# EAGLE schematic StepperDriver (EAGLE 7.2.0)
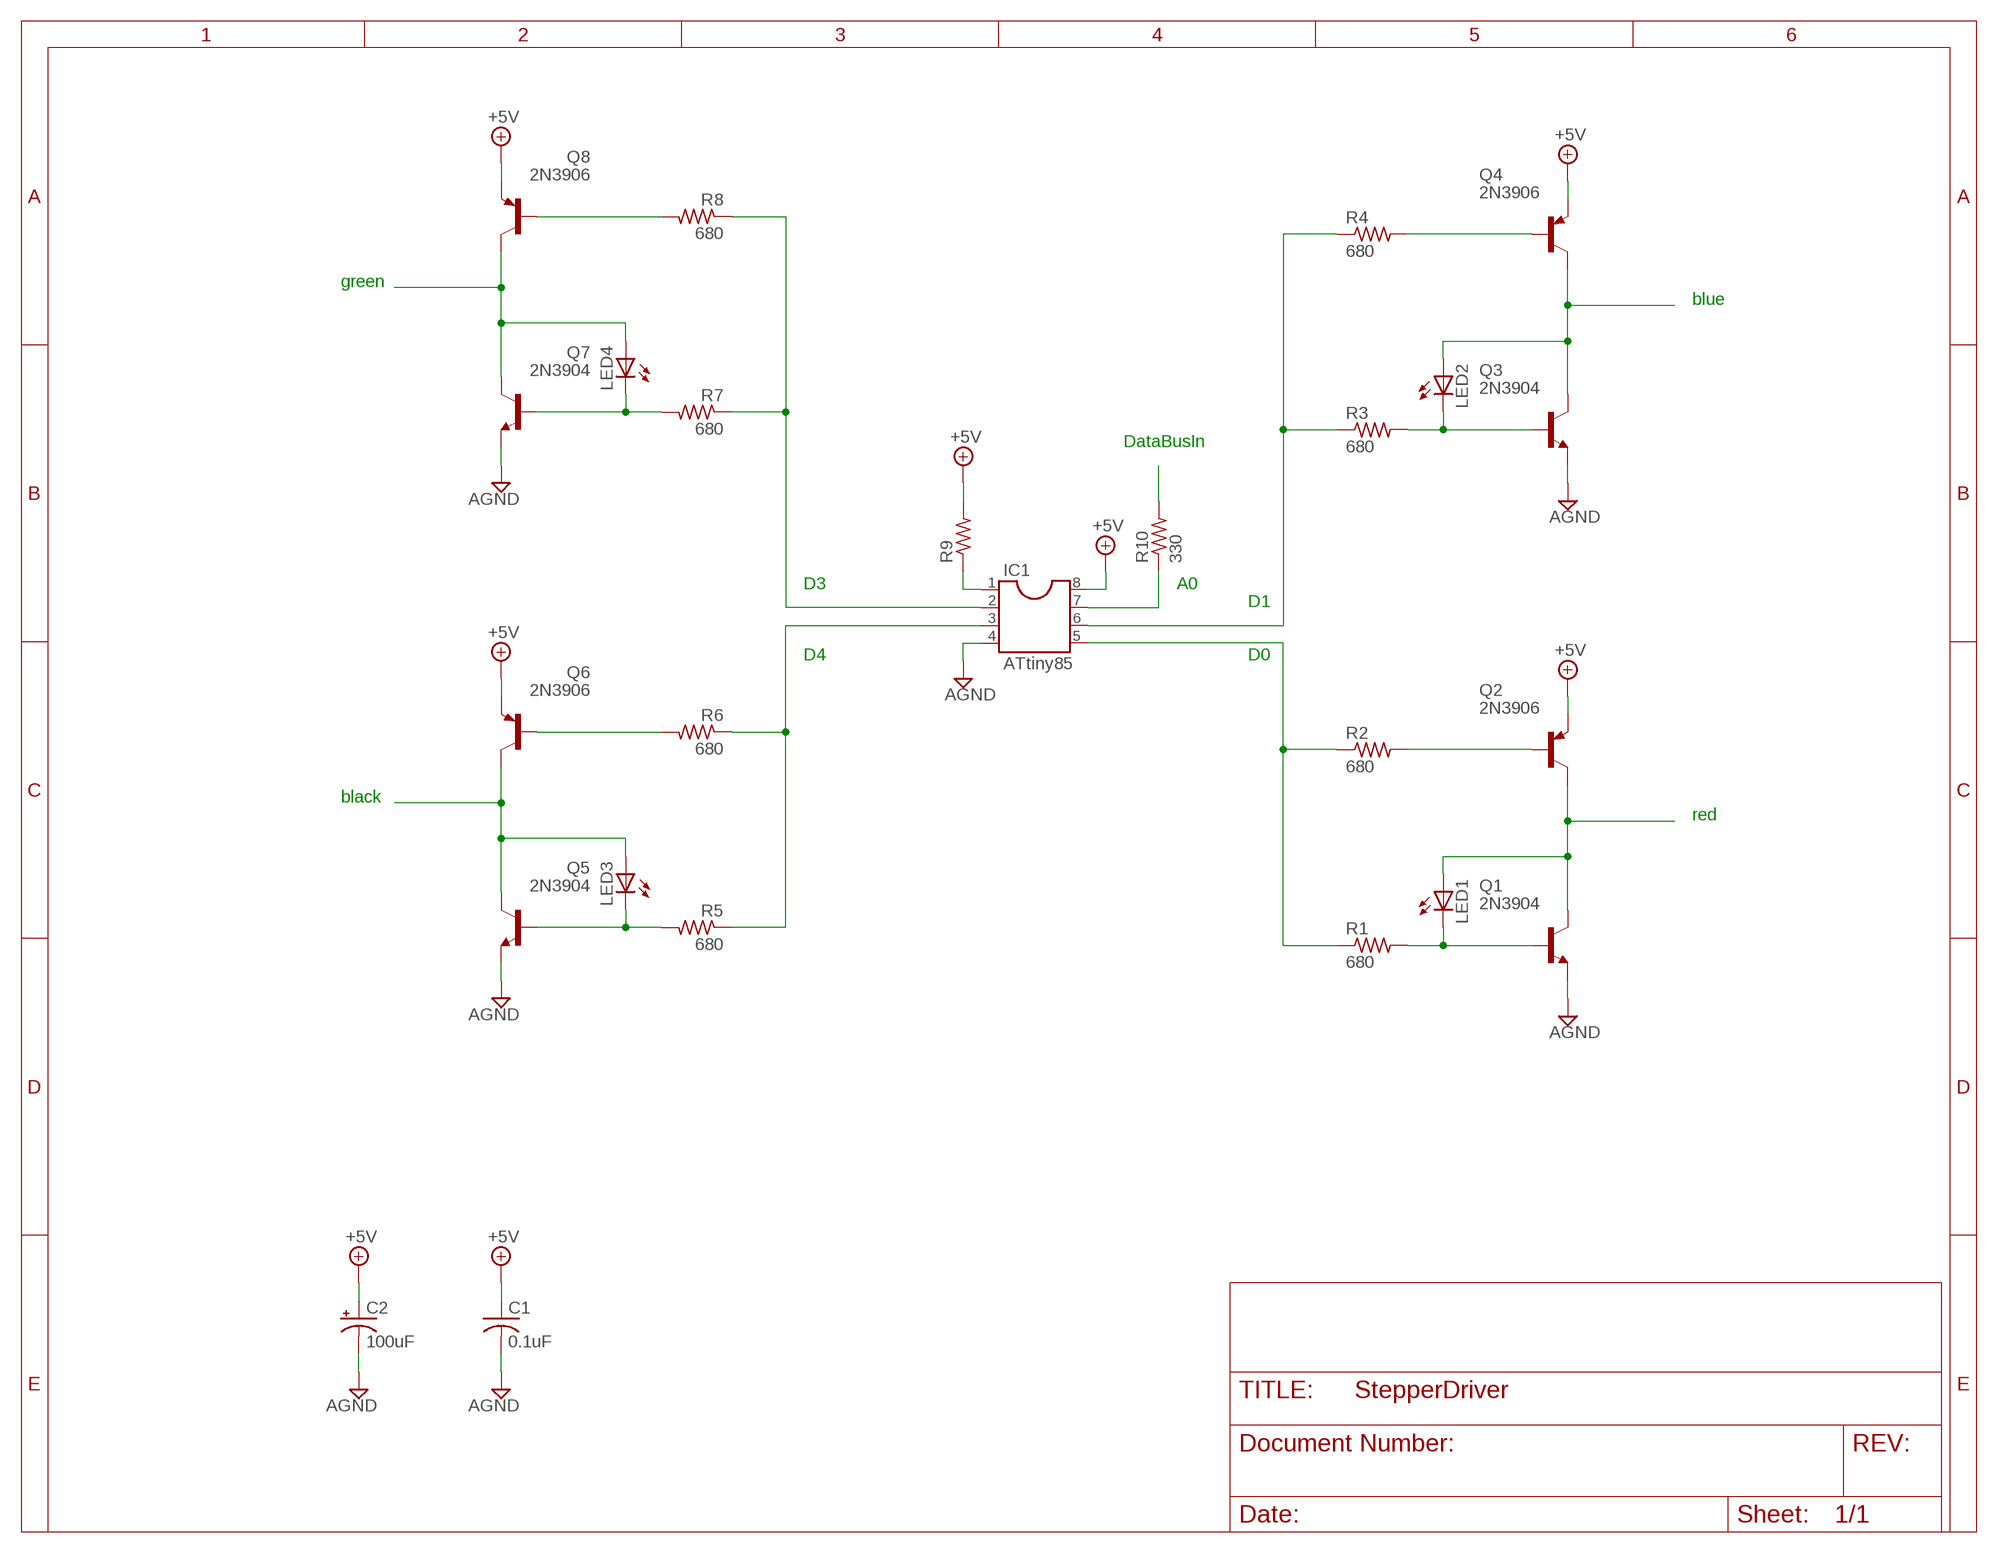
[diagram p0: schematic, sheet 1]

## Parts
C1  0.1uF  C-US025-050X050  [C025-050X050]
C2  100uF  CPOL-USE2,5-6E  [E2,5-6E]
IC1  ATtiny85  DIL8  [DIL08]
LED1  LED5MM  [LED5MM]
LED2  LED5MM  [LED5MM]
LED3  LED5MM  [LED5MM]
LED4  LED5MM  [LED5MM]
Q1  2N3904  [TO92]
Q2  2N3906  [TO92]
Q3  2N3904  [TO92]
Q4  2N3906  [TO92]
Q5  2N3904  [TO92]
Q6  2N3906  [TO92]
Q7  2N3904  [TO92]
Q8  2N3906  [TO92]
R1  680  R-US_VMTA55  [VMTA55]
R2  680  R-US_VMTA55  [VMTA55]
R3  680  R-US_VMTA55  [VMTA55]
R4  680  R-US_VMTA55  [VMTA55]
R5  680  R-US_VMTA55  [VMTA55]
R6  680  R-US_VMTA55  [VMTA55]
R7  680  R-US_VMTA55  [VMTA55]
R8  680  R-US_VMTA55  [VMTA55]
R9  R-US_VMTA55  [VMTA55]
R10  330  R-US_VMTA55  [VMTA55]

## Nets
+5V: C1.1 C2.+ IC1.8 Q2.3(E) Q4.3(E) Q6.3(E) Q8.3(E) R9.2
A0: IC1.7 R10.1
AGND: C1.2 C2.- IC1.4 Q1.3(E) Q3.3(E) Q5.3(E) Q7.3(E)
D0: IC1.5 R1.1 R2.1
D1: IC1.6 R3.1 R4.1
D3: IC1.2 R7.1 R8.1
D4: IC1.3 R5.1 R6.1
N$1: LED2.K(C) Q3.2(B) R3.2
N$2: LED2.A Q3.1(C) Q4.1(C)
N$3: IC1.1 R9.1
N$4: Q4.2(B) R4.2
N$5: LED1.K(C) Q1.2(B) R1.2
N$6: LED1.A Q1.1(C) Q2.1(C)
N$7: Q2.2(B) R2.2
N$8: LED4.K(C) Q7.2(B) R7.2
N$9: LED4.A Q7.1(C) Q8.1(C)
N$10: Q8.2(B) R8.2
N$11: LED3.K(C) Q5.2(B) R5.2
N$12: LED3.A Q5.1(C) Q6.1(C)
N$13: Q6.2(B) R6.2
N$14: R10.2

## Notes on the sheet
- green
- blue
- DataBusIn
- D3 | A0
- D1
- D4 | D0
- black
- red

## Library data of the parts
C1 = rcl:C-US: CAPACITOR, American symbol
C2 = rcl:CPOL-US: POLARIZED CAPACITOR, American symbol
IC1 = ic-package:DIL8: Dual In Line / Socket
LED1-LED4 = led:LED: LED OSRAM: - CHIPLED LG R971, LG N971, LY N971, LG Q971, LY Q971, LO R971, LY R971 LH N974, LH R974 LS Q976, LO Q976, LY Q976 LO Q996 - Hyper CHIPLED LW Q18S LB Q993, LB Q99A, LB R99A - SideLED LS A670, LO A670, LY A670, LG A670, LP A670 LB A673, LV A673, LT A673, LW A673 LH A674 LY A675 LS A676, LA A676, LO A676, LY A676, LW A676 LS A679, LY A679, LG A679 - Hyper Micro SIDELED® LS Y876, LA Y876, LO Y876, LY Y876 LT Y87S - SmartLED LW L88C, LW L88S LB L89C, LB L89S, LG L890 LS L89K, LO L89K, LY L89K LS L896, LA L896, LO L896, LY L896 - TOPLED LS T670, LO T670, LY T670, LG T670, LP T670 LSG T670, LSP T670, LSY T670, LOP T670, LYG T670 LG T671, LOG T671, LSG T671 LB T673, LV T673, LT T673, LW T673 LH T674 LS T676, LA T676, LO T676, LY T676, LB T676, LH T676, LSB T676, LW T676 LB T67C, LV T67C, LT T67C, LS T67K, LO T67K, LY T67K, LW E67C LS E67B, LA E67B, LO E67B, LY E67B, LB E67C, LV E67C, LT E67C LW T67C LS T679, LY T679, LG T679 LS T770, LO T770, LY T770, LG T770, LP T770 LB T773, LV T773, LT T773, LW T773 LH T774 LS E675, LA E675, LY E675, LS T675 LS T776, LA T776, LO T776, LY T776, LB T776 LHGB T686 LT T68C, LB T68C - Hyper Mini TOPLED® LB M676 - Mini TOPLED Santana® LG M470 LS M47K, LO M47K, LY M47K Source: http://www.osram.convergy.de LUXEON: - LUMILED® LXK2-PW12-R00, LXK2-PW12-S00, LXK2-PW14-U00, LXK2-PW14-V00 LXK2-PM12-R00, LXK2-PM12-S00, LXK2-PM14-U00 LXK2-PE12-Q00, LXK2-PE12-R00, LXK2-PE12-S00, LXK2-PE14-T00, LXK2-PE14-U00 LXK2-PB12-K00, LXK2-PB12-L00, LXK2-PB12-M00, LXK2-PB14-N00, LXK2-PB14-P00, LXK2-PB14-Q00 LXK2-PR12-L00, LXK2-PR12-M00, LXK2-PR14-Q00, LXK2-PR14-R00 LXK2-PD12-Q00, LXK2-PD12-R00, LXK2-PD12-S00 LXK2-PH12-R00, LXK2-PH12-S00 LXK2-PL12-P00, LXK2-PL12-Q00, LXK2-PL12-R00 Source: www.luxeon.com KINGBRIGHT: KA-3528ASYC Source: www.kingbright.com
Q1 Q3 Q5 Q7 = transistor-npn:2N3904: NPN Transistor
Q2 Q4 Q6 Q8 = transistor-pnp:2N3906: PNP Transistor
R1-R10 = resistor:R-US_: RESISTOR, American symbol